# EAGLE design untitled (EAGLE 7.2.0)
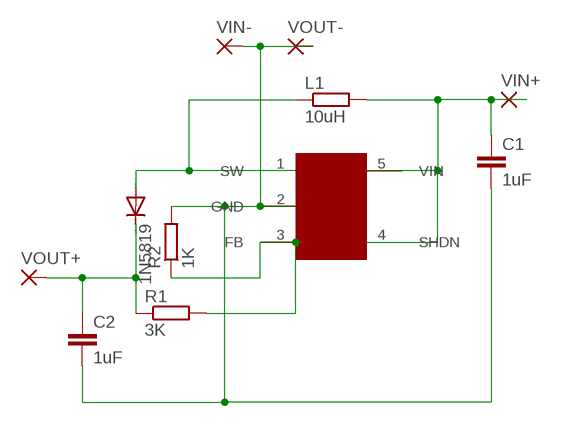
[diagram p0: schematic, sheet 1]

## Parts
1N5819  DIODE-DO214AC  [DO214AC]
C1  1uF  C-EUC1206  [C1206]
C2  1uF  C-EUC1206  [C1206]
L1  10uH  R-EU_R0805  [R0805]
R1  3K  R-EU_R1206  [R1206]
R2  1K  R-EU_R1206  [R1206]
U$8  AP3012  [SOT-23-5]
VIN+  SMD2  [SMD1,27-2,54]
VIN-  SMD2  [SMD1,27-2,54]
VOUT+  SMD2  [SMD1,27-2,54]
VOUT-  SMD2  [SMD1,27-2,54]

## Nets
N$1: 1N5819.A L1.1 U$8.1(SW)
N$2: C1.1 L1.2 U$8.4(SHDN) U$8.5(VIN) VIN+.1(P)
N$3: 1N5819.C C2.1 R1.1 VOUT+.1(P)
N$4: R1.2 R2.1 U$8.3(FB)
N$7: C1.2 C2.2 R2.2 U$8.2(GND) VIN-.1(P) VOUT-.1(P)

## Library data of the parts
1N5819 = diode:DIODE-: DIODE
C1 C2 = resistor:C-EU: CAPACITOR, European symbol
L1 R1 R2 = resistor:R-EU_: RESISTOR, European symbol
U$8 = smd-footprints:AP3012
VIN+ VIN- VOUT+ VOUT- = wirepad:SMD2: SMD PAD

## Board
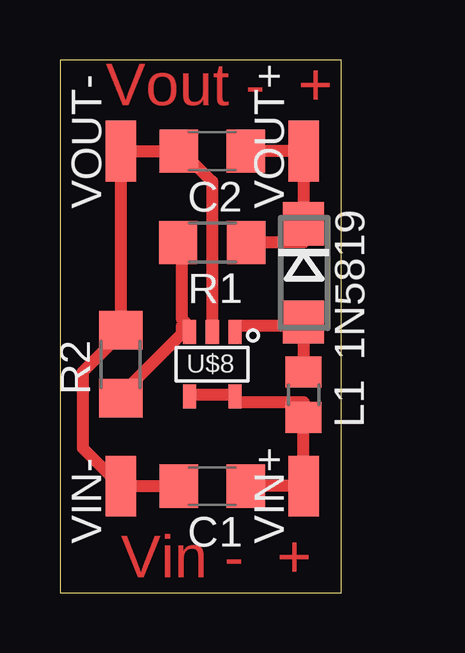
[diagram p1: board, top side]

Size 11.74 x 22.21 mm. Coordinates in mm from the lower left corner, seen from the top.
Outline: 0,0 11.74,0 11.74,22.21 0,22.21 0,0
Copper layers (1*16): Top 0.035mm / dielectric 1.5mm / Bottom 0.035mm
Design rules "default *": minimum track width 20mil, minimum drill 24mil, track to track 8mil, track to pad 8mil, pad to pad 8mil, via to via 8mil, smd to smd 8mil, copper to edge 40mil, drill to drill 8mil, minimum pad ring 10mil, minimum via ring 8mil, stop-mask expansion 4mil, vias tented up to drill 0mil, thermal gap 10mil

### Footprints (pad centres in the part's own frame; a part is rotated, then mirrored left to right if it is on the bottom)
DO214AC = smd 1.8 x 1.7: A 2.05,0; C -2.05,0
C1206 = smd 1.6 x 1.8: 1 -1.4,0; 2 1.4,0
R0805 = smd 1.3 x 1.5: 1 -0.95,0; 2 0.95,0
R1206 = smd 1.6 x 1.803: 1 -1.422,0; 2 1.422,0
SOT-23-5 = smd 1 x 0.55: 1 -1.35,0.95; 2 -1.35,0; 3 -1.35,-0.95; 4 1.35,-0.95; 5 1.35,0.95
SMD1,27-2,54 = smd 1.27 x 2.54: 1 0,0

### Placement (x,y rotation side)
1N5819  10.16,13.34 270 top
C1  6.35,4.45 180 top
C2  6.35,18.41 180 top
L1  10.16,8.26 270 top
R1  6.35,14.61 180 top
R2  2.54,9.53 90 top
U$8  6.35,9.53 270 top
VIN+  10.16,4.45 0 top
VIN-  2.54,4.45 0 top
VOUT+  10.16,18.41 0 top
VOUT-  2.54,18.41 0 top

### Tracks (layer width: path | path; a pad name or v marks a point on that pad's centre or on a via)
N$1
  Top 0.508: 10.16,11.11 7.3,11.11 U$8.1 | 10.16,11.11 L1.1 | 10.16,11.11 1N5819.A
N$2
  Top 0.508: U$8.4 5.4,8.26 7.3,8.26 U$8.5 7.3,7.94 10.16,7.94 L1.2 VIN+.1 C1.1
N$3
  Top 0.508: C2.1 VOUT+.1 1N5819.C 10.16,14.61 R1.1
N$4
  Top 0.508: 5.24,11.27 5.08,11.43 5.08,14.61 R1.2 | 5.24,11.27 5.4,11.11 U$8.3 | R2.1 2.54,8.26 5.08,10.79 5.08,11.11 5.24,11.27
N$7
  Top 0.508: U$8.2 6.35,17.14 5.08,18.41 C2.2 VOUT-.1 R2.2 2.54,10.79 0.95,9.21 0.95,6.03 VIN-.1 C1.2

### Text on the board
Top: Vout - + | Vin - +